# EAGLE design L3DCube_16LED_Rev1 (EAGLE 6.4)
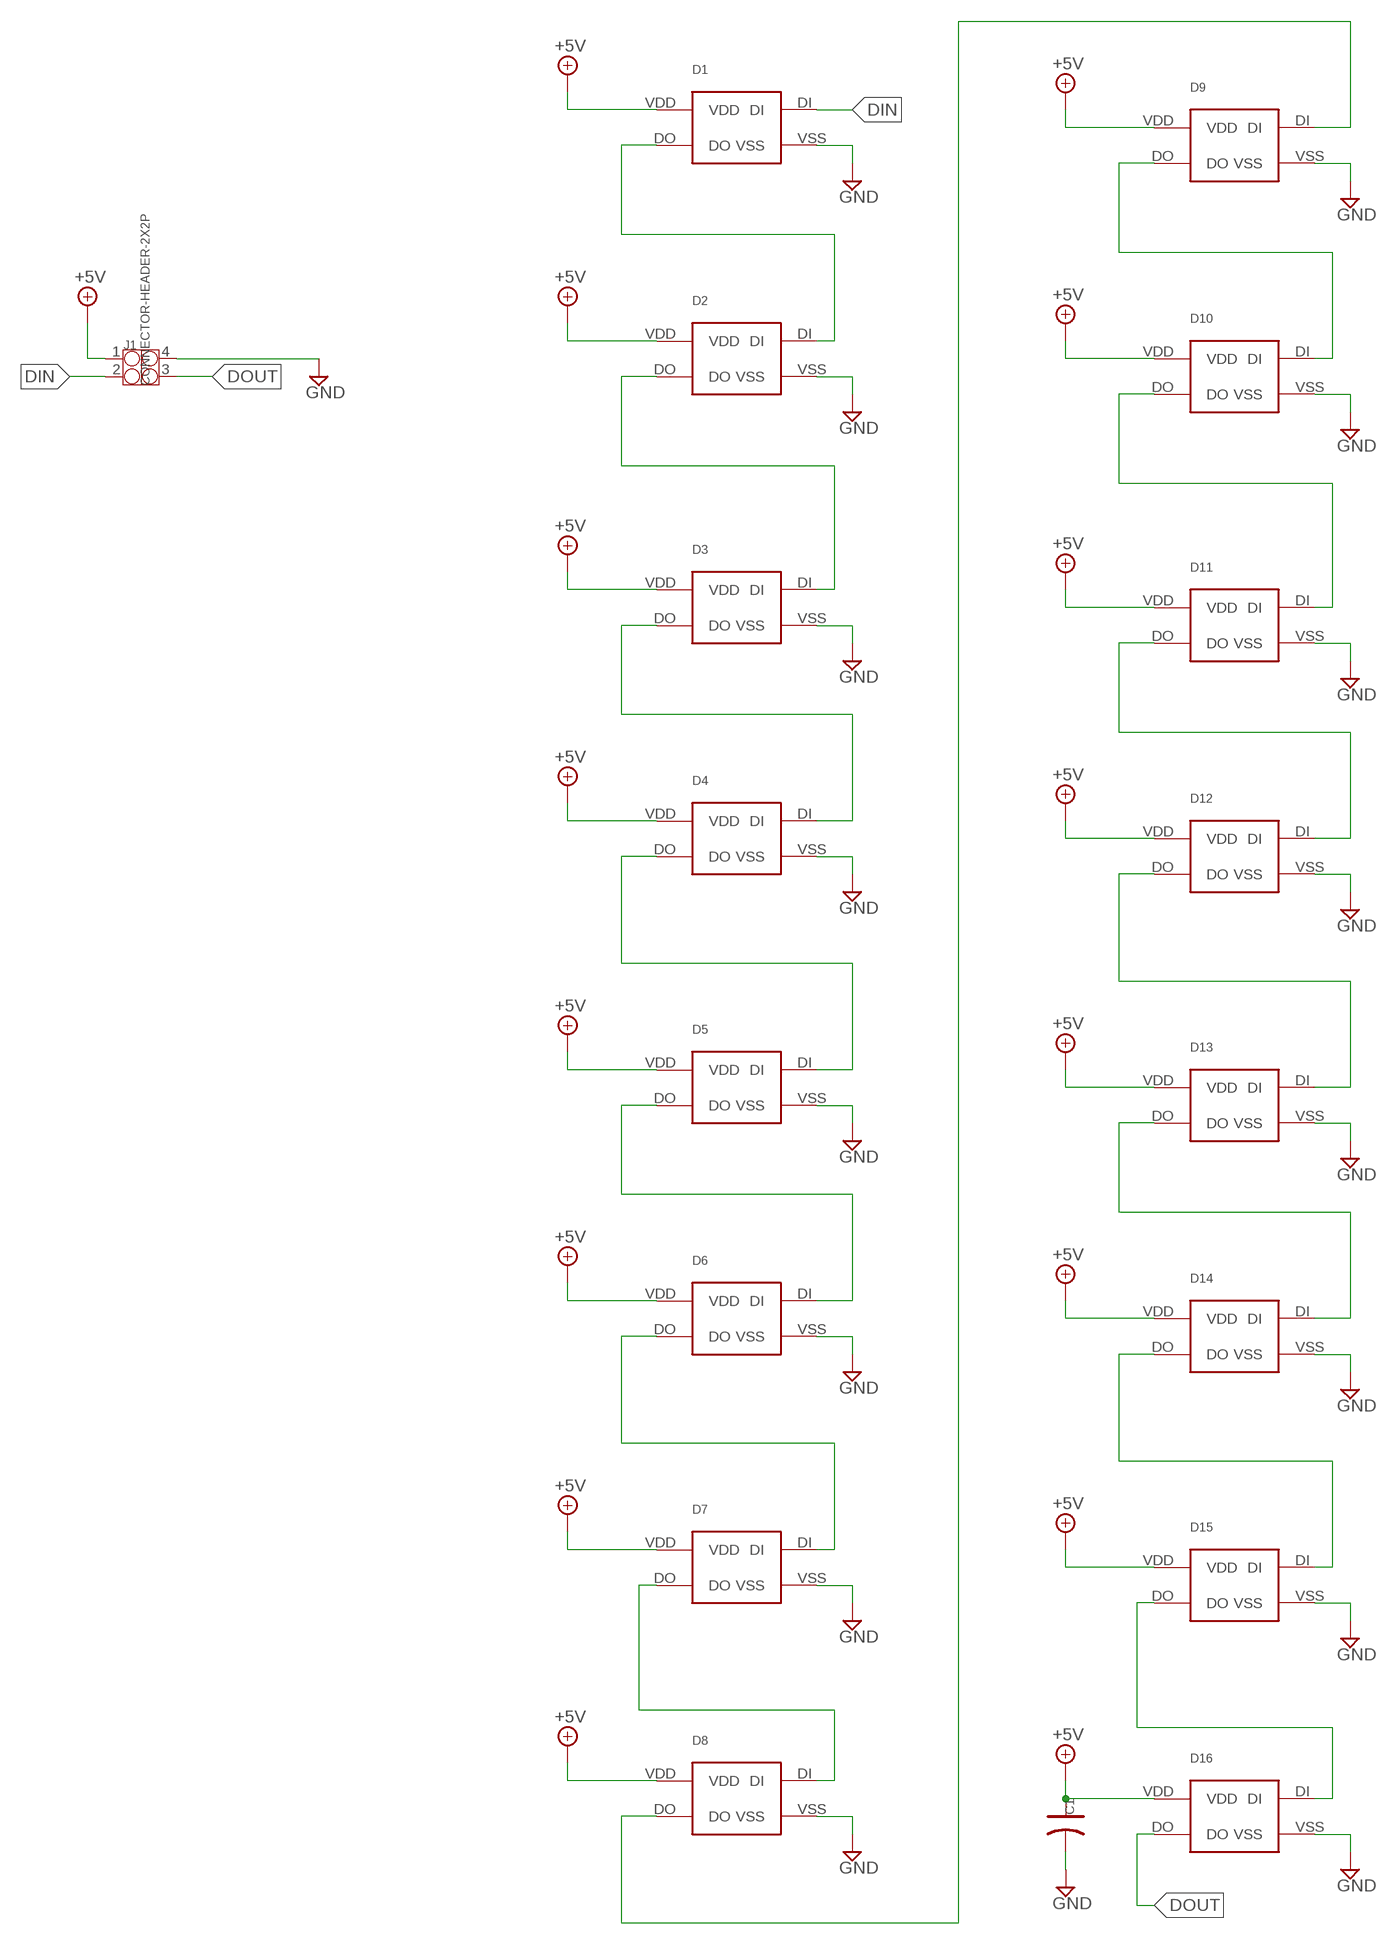
[diagram p0: schematic, sheet 1]

## Parts
C1  C-POLAR-A  [AVX-A]
D1  WS2812B  [WS2812B]
D2  WS2812B  [WS2812B]
D3  WS2812B  [WS2812B]
D4  WS2812B  [WS2812B]
D5  WS2812B  [WS2812B]
D6  WS2812B  [WS2812B]
D7  WS2812B  [WS2812B]
D8  WS2812B  [WS2812B]
D9  WS2812B  [WS2812B]
D10  WS2812B  [WS2812B]
D11  WS2812B  [WS2812B]
D12  WS2812B  [WS2812B]
D13  WS2812B  [WS2812B]
D14  WS2812B  [WS2812B]
D15  WS2812B  [WS2812B]
D16  WS2812B  [WS2812B]
J1  CONNECTOR-HEADER-2X2P  [2X2P-2.54]

## Nets
+5V: C1.+ D1.VDD D2.VDD D3.VDD D4.VDD D5.VDD D6.VDD D7.VDD D8.VDD D9.VDD D10.VDD D11.VDD D12.VDD D13.VDD D14.VDD D15.VDD D16.VDD J1.1
DIN: D1.DI J1.2
DOUT: D16.DO J1.3
GND: C1.- D1.VSS D2.VSS D3.VSS D4.VSS D5.VSS D6.VSS D7.VSS D8.VSS D9.VSS D10.VSS D11.VSS D12.VSS D13.VSS D14.VSS D15.VSS D16.VSS J1.4
N$1: D1.DO D2.DI
N$2: D2.DO D3.DI
N$3: D3.DO D4.DI
N$4: D4.DO D5.DI
N$5: D5.DO D6.DI
N$6: D6.DO D7.DI
N$7: D7.DO D8.DI
N$8: D9.DO D10.DI
N$9: D10.DO D11.DI
N$10: D11.DO D12.DI
N$11: D12.DO D13.DI
N$12: D13.DO D14.DI
N$13: D14.DO D15.DI
N$14: D15.DO D16.DI
N$15: D8.DO D9.DI

## Library data of the parts
C1 = OPL Eagle Library:C-POLAR*
D1-D16 = lumex:WS2812B
J1 = OPL Eagle Library:CONNECTOR-HEADER-2X2P

## Board
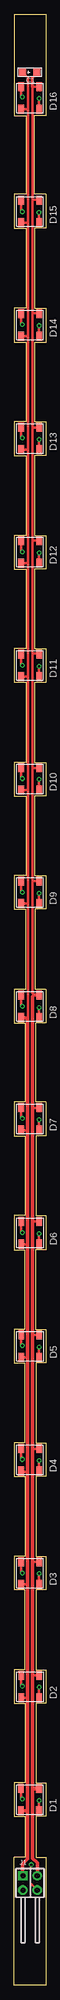
[diagram p1: board, top side]
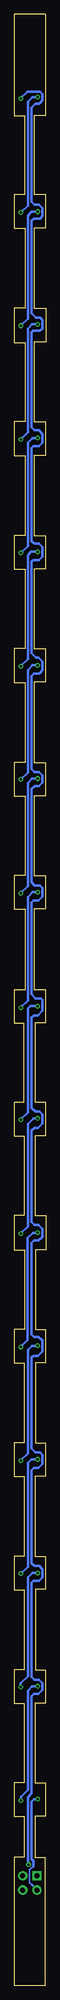
[diagram p2: board, bottom side, seen from below]

Size 5.63 x 347.38 mm. Coordinates in mm from the lower left corner, seen from the top.
Outline: 5.62,175.52 5.62,169.57 3.85,169.57 3.85,155.7 5.62,155.7 5.62,149.71 3.85,149.71 3.85,135.63 5.62,135.63 5.62,129.59 3.8,129.59 3.8,115.62 5.62,115.62 5.62,109.67 3.85,109.67 3.85,95.55 5.62,95.55 5.62,89.66 3.85,89.66 3.85,75.64 5.62,75.64 5.62,69.7 3.85,69.7 3.85,55.57 5.62,55.57 5.62,49.68 3.85,49.68 3.85,35.66 5.62,35.66 5.62,29.77 3.85,29.77 3.85,22.55 5.62,22.55 5.62,0 0.05,0 0.05,22.55 1.92,22.55 1.92,29.77 0.05,29.77 0.05,35.66 1.92,35.66 1.92,49.68 0.05,49.68 0.05,55.57 1.87,55.57 1.87,69.75 0.05,69.75 0.05,75.64 1.92,75.64 1.92,89.66 0.05,89.66 0.05,95.55 1.87,95.55 1.87,109.67 0.05,109.67 0.05,115.62 1.87,115.62 1.87,129.64 0,129.64 0,135.63 1.92,135.63 1.92,149.71 0.05,149.71 0.05,155.7 1.92,155.7 1.92,169.57 0.05,169.57 0.05,175.52
Outline: 0.04,175.51 2.07,175.51 2.07,189.68 0.05,189.68 0.05,195.58 2.13,195.58 2.13,209.6 0.05,209.6 0.05,215.49 2.13,215.49 2.13,229.66 0.05,229.66 0.05,235.56 2.13,235.56 2.13,249.58 0.05,249.58 0.05,255.47 2.13,255.47 2.13,269.59 0.05,269.59 0.05,275.54 2.13,275.54 2.13,289.56 0,289.56 0,295.55 2.13,295.55 2.13,309.62 0.05,309.62 0.05,315.62 2.13,315.62 2.13,329.49 0.05,329.49 0.05,347.38 5.62,347.38 5.62,329.49 3.65,329.49 3.65,315.62 5.62,315.62 5.62,309.62 3.65,309.62 3.65,295.55 5.62,295.55 5.62,289.51 3.65,289.51 3.65,275.54 5.62,275.54 5.62,269.59 3.65,269.59 3.65,255.47 5.62,255.47 5.62,249.58 3.65,249.58 3.65,235.56 5.62,235.56 5.62,229.61 3.65,229.61 3.65,215.49 5.62,215.49 5.62,209.6 3.65,209.6 3.65,195.58 5.62,195.58 5.62,189.68 3.7,189.68 3.7,175.51 5.63,175.51
Copper layers (1*16): Top 0.035mm / dielectric 1.5mm / Bottom 0.035mm
Design rules "default *": minimum track width 10mil, minimum drill 24mil, track to track 8mil, track to pad 8mil, pad to pad 8mil, via to via 8mil, smd to smd 8mil, copper to edge 40mil, drill to drill 8mil, minimum pad ring 10mil, minimum via ring 8mil, stop-mask expansion 4mil, vias tented up to drill 20mil, thermal gap 10mil

### Footprints (pad centres in the part's own frame; a part is rotated, then mirrored left to right if it is on the bottom)
AVX-A = smd 1.27 x 1.27: + -1.27,0; - 1.27,0
WS2812B = smd 1.6 x 1: DI 4.2,0; DO 0.2,-3.2; VDD 0.2,0; VSS 4.2,-3.2
2X2P-2.54 = drill 0.889 pad 1.651 square: 1 -1.27,1.27 | drill 0.889 pad 1.651: 2 -1.27,-1.27; 3 1.27,-1.27; 4 1.27,1.27

### Placement (x,y rotation side)
C1  2.79,337.16 0 top
D1  1.21,30.52 90 top
D2  1.26,50.43 90 top
D3  1.23,70.46 90 top
D4  1.23,90.41 90 top
D5  1.28,110.46 90 top
D6  1.28,130.41 90 top
D7  1.25,150.51 90 top
D8  1.24,170.31 90 top
D9  1.24,190.41 90 top
D10  1.24,210.41 90 top
D11  1.24,230.41 90 top
D12  1.24,250.41 90 top
D13  1.24,270.41 90 top
D14  1.24,290.41 90 top
D15  1.24,310.41 90 top
D16  1.24,330.41 90 top
J1  2.84,18.03 0 top

### Tracks (layer width: path | path; a pad name or v marks a point on that pad's centre or on a via)
+5V
  Top 0.254: 0.96,30.73 D1.VDD
  Top 0.406: D2.VDD 1.27,50.65 2.43,50.65 | D8.VDD 1.27,170.48 2.33,170.48 | D7.VDD 1.34,150.62 2.43,150.62 | D6.VDD 1.34,130.55 2.43,130.55 | D5.VDD 1.33,110.61 2.43,110.61 | D4.VDD 1.35,90.5 2.43,90.5 | D3.VDD 1.26,70.69 2.43,70.69 | D16.VDD 2.4,330.61 2.51,330.5 | D15.VDD 2.33,310.61 2.51,310.79 | D14.VDD 2.47,290.61 2.51,290.65 | D13.VDD 2.38,270.61 2.51,270.48 | D12.VDD 2.32,250.61 2.51,250.8 | D11.VDD 2.4,230.61 2.51,230.5 | D10.VDD 2.45,210.61 2.51,210.67 | D9.VDD 2.37,190.61 2.51,190.47
  Top 0.457: D8.VDD 2.48,170.51 2.51,170.53 2.51,190.47 2.51,210.67 2.51,230.5 2.51,250.8 2.51,270.48 2.51,290.65 2.51,310.79 2.51,330.5 2.51,336.18 C1.+
  Top 0.61: 2.43,30.73 2.43,22.27 1.54,21.38 1.54,19.33 J1.1 | 2.43,30.73 2.29,30.72 D1.VDD 1.22,30.73 2.43,30.73 | 2.43,30.73 2.43,50.65 2.43,70.69 2.43,90.5 2.43,110.61 2.43,130.55 2.43,150.62 2.43,170.51 D8.VDD
DIN  (via drill 0.41)
  Top 0.254: 1.31,34.77 D1.DI
  Top 0.406: v1.44,32.81 1.21,33.04 D1.DI
  Bottom 0.254: 2.48,17.68 2.86,18.06 2.86,20.32 2.2,20.98
  Bottom 0.406: J1.2 2.48,17.68 | v1.44,32.81 2.1,32.81 2.53,32.38 2.53,22.25 2.2,21.92 2.2,20.98
DOUT  (via drill 0.41)
  Top 0.254: 3.19,17.68 2.89,17.98 2.89,21.08 v3.06,21.26
  Top 0.406: D16.DO v4.44,332.53 | J1.3 3.19,17.68
  Bottom 0.406: v4.44,332.53 3.22,333.75 1.01,333.75 0.58,333.27 0.58,332.2 1.16,331.57 1.82,331.57 2.53,330.86 2.53,314.37 1.97,313.81 1.19,313.81 0.58,313.15 0.58,311.83 0.98,311.38 2.13,311.38 2.53,310.97 2.53,294.69 1.74,293.9 0.98,293.9 0.58,293.49 0.58,292 1.01,291.56 2.25,291.56 2.53,291.28 2.53,274.57 2,274.04 1.24,274.04 0.58,273.38 0.58,271.85 1.21,271.22 2.15,271.22 2.51,270.86 2.51,254.56 2.05,254.1 1.21,254.1 0.58,253.46 0.58,251.81 1.19,251.2 2.2,251.2 2.53,250.87 2.53,234.8 1.74,234.01 1.29,234.01 0.58,233.3 0.58,231.75 1.16,231.16 2.13,231.16 2.53,230.76 2.53,214.32 2.02,213.81 1.19,213.81 0.58,213.21 0.58,211.99 1.19,211.38 1.95,211.38 2.53,210.79 2.53,194.41 1.97,193.85 1.01,193.85 0.58,193.42 0.58,191.87 1.26,191.18 2.15,191.18 2.53,190.8 2.53,174.67 1.8,173.94 0.88,173.94 0.58,173.63 0.58,171.78 1.41,170.94 2.13,170.94 2.53,170.53 2.53,154.66 1.87,154 1.11,154 0.58,153.46 0.58,151.91 1.36,151.13 2.05,151.13 2.53,150.64 2.53,134.52 2,133.98 1.29,133.98 0.63,133.32 0.63,131.93 1.31,131.24 2.13,131.24 2.53,130.83 2.53,114.73 2.07,114.27 1.26,114.27 0.63,113.64 0.63,111.71 1.39,110.94 2.23,110.94 2.53,110.64 2.53,94.59 1.87,93.93 1.01,93.93 0.58,93.49 0.58,91.89 1.29,91.18 2.1,91.18 2.53,90.75 2.53,74.39 2.05,73.91 1.16,73.91 0.58,73.33 0.58,71.9 1.19,71.3 2.2,71.3 2.53,70.97 2.53,54.35 2.02,53.85 1.19,53.85 0.6,53.26 0.6,52.07 1.29,51.38 2.1,51.38 2.53,50.95 2.53,33.8 3.17,33.17 3.17,21.82 3.06,21.71 v3.06,21.26
GND
  Top 0.254: 4.21,134.69 D6.VSS | 4.41,174.68 D8.VSS
  Top 0.406: D16.VSS 4.42,334.59 3.27,334.59 | D2.VSS 3.29,54.63 | D15.VSS 4.35,314.7 3.24,314.7 | D14.VSS 4.34,294.71 3.32,294.71 3.24,294.79 | D13.VSS 4.35,274.52 3.4,274.52 3.24,274.37 | 4.34,254.51 D12.VSS 3.29,254.61 3.24,254.66 | D11.VSS 4.36,234.69 3.29,234.69 3.24,234.64 | D10.VSS 4.33,214.5 3.27,214.5 3.24,214.48 | D9.VSS 4.42,194.59 3.37,194.59 3.24,194.46 | D7.VSS 4.39,154.66 3.29,154.66 | D6.VSS 4.46,134.59 3.29,134.59 | D5.VSS 4.45,114.63 3.29,114.63 | D4.VSS 4.36,94.54 3.29,94.54 | D3.VSS 4.39,74.62 3.29,74.62
  Top 0.457: 3.29,174.24 3.56,174.51 | 3.27,336.17 3.27,334.59 3.22,334.59 3.22,336.19 3.24,336.19 3.24,314.7 3.24,294.79 3.24,274.37 3.24,254.66 3.24,234.64 3.24,214.48 3.24,194.46 3.24,174.88 3.57,174.55
  Top 0.559: 4.41,174.68 4.28,174.55 3.57,174.55 3.27,174.24 3.27,174.17 | 3.27,336.17 4.06,336.96 C1.-
  Top 0.61: 3.29,34.59 3.29,22.43 4.13,21.59 4.13,19.33 J1.4 | 3.29,34.59 3.29,34.64 | 3.29,34.64 3.42,34.72 D1.VSS 4.28,34.59 3.29,34.59 | 3.29,34.64 3.29,54.63 3.29,74.62 3.29,94.54 3.29,114.63 3.29,134.59 3.29,154.66 3.29,174.24 | 3.56,174.51 D8.VSS
N$1  (via drill 0.41)
  Top 0.406: D1.DO 4.44,30.75 v4.44,32.59 | v1.44,52.7 1.26,52.88 D2.DI
  Bottom 0.406: v4.44,32.59 4.41,32.61 4.41,33.2 3.19,34.41 3.19,51.92 2.4,52.7 v1.44,52.7
N$2  (via drill 0.41)
  Top 0.406: D2.DO 4.44,50.66 v4.44,52.55 | v1.44,72.67 1.23,72.87 D3.DI
  Bottom 0.406: v4.44,52.55 4.44,53.24 3.19,54.48 3.19,71.85 2.38,72.67 v1.44,72.67
N$3  (via drill 0.41)
  Top 0.406: D3.DO v4.44,72.54 | v1.44,92.68 1.23,92.89 D4.DI
  Bottom 0.406: v4.44,72.54 3.19,73.78 3.19,92.05 2.56,92.68 v1.44,92.68
N$4  (via drill 0.41)
  Top 0.406: D4.DO v4.44,92.48 | v1.44,112.72 1.28,112.88 D5.DI
  Bottom 0.406: v4.44,92.48 3.19,93.72 3.19,112.01 2.48,112.72 v1.44,112.72
N$5  (via drill 0.41)
  Top 0.406: D5.DO 4.44,110.71 v4.44,112.49 | v1.44,132.64 1.28,132.79 D6.DI
  Bottom 0.406: v4.44,112.49 3.22,113.71 3.22,131.72 2.3,132.64 v1.44,132.64
N$6  (via drill 0.41)
  Top 0.406: D6.DO 4.44,130.66 v4.44,132.48 | v1.44,152.78 1.24,152.97 D7.DI
  Bottom 0.406: v4.44,132.48 3.19,133.73 3.19,151.81 2.23,152.78 v1.44,152.78
N$7  (via drill 0.41)
  Top 0.406: D7.DO v4.44,152.55 | v1.44,172.57 1.24,172.76 D8.DI
  Bottom 0.406: v4.44,152.55 3.19,153.79 3.19,154.15 3.17,154.18 3.17,172.11 2.71,172.57 v1.44,172.57
N$8  (via drill 0.41)
  Top 0.406: D9.DO v4.44,192.48 | v1.44,212.67 1.24,212.87 D10.DI
  Bottom 0.406: v4.44,192.48 3.19,193.72 3.19,211.88 2.4,212.67 v1.44,212.67
N$9  (via drill 0.41)
  Top 0.406: D10.DO v4.44,212.52 | v1.44,232.64 1.24,232.83 D11.DI
  Bottom 0.406: v4.44,212.52 3.19,213.76 3.19,231.8 2.35,232.64 v1.44,232.64
N$10  (via drill 0.41)
  Top 0.406: D11.DO v4.44,232.46 | v1.44,252.63 1.24,252.82 D12.DI
  Bottom 0.406: v4.44,232.46 3.19,233.7 3.19,252.04 2.61,252.63 v1.44,252.63
N$11  (via drill 0.41)
  Top 0.406: D12.DO v4.44,252.42 | v1.44,272.69 1.24,272.89 D13.DI
  Bottom 0.406: v4.44,252.42 3.19,253.67 3.19,271.83 2.33,272.69 v1.44,272.69
N$12  (via drill 0.41)
  Top 0.406: D13.DO v4.44,272.44 | v1.44,292.71 1.24,292.9 D14.DI
  Bottom 0.406: v4.44,272.44 3.19,273.68 3.19,291.97 2.46,292.71 v1.44,292.71
N$13  (via drill 0.41)
  Top 0.406: D14.DO v4.44,292.48 | v1.44,312.57 1.24,312.77 D15.DI
  Bottom 0.406: v4.44,292.48 3.19,293.72 3.19,311.91 2.53,312.57 v1.44,312.57
N$14  (via drill 0.41)
  Top 0.406: D15.DO 4.41,310.64 v4.41,312.44 | v1.44,332.79 1.24,332.99 D16.DI
  Bottom 0.406: v4.41,312.44 3.19,313.66 3.19,331.98 2.38,332.79 v1.44,332.79
N$15  (via drill 0.41)
  Top 0.406: D8.DO v4.44,172.31 | v1.44,192.63 1.24,192.83 D9.DI
  Bottom 0.406: v4.44,172.31 3.19,173.56 3.19,191.77 2.33,192.63 v1.44,192.63